# EAGLE design LCD_Shield_v1.0 (EAGLE 5.10)
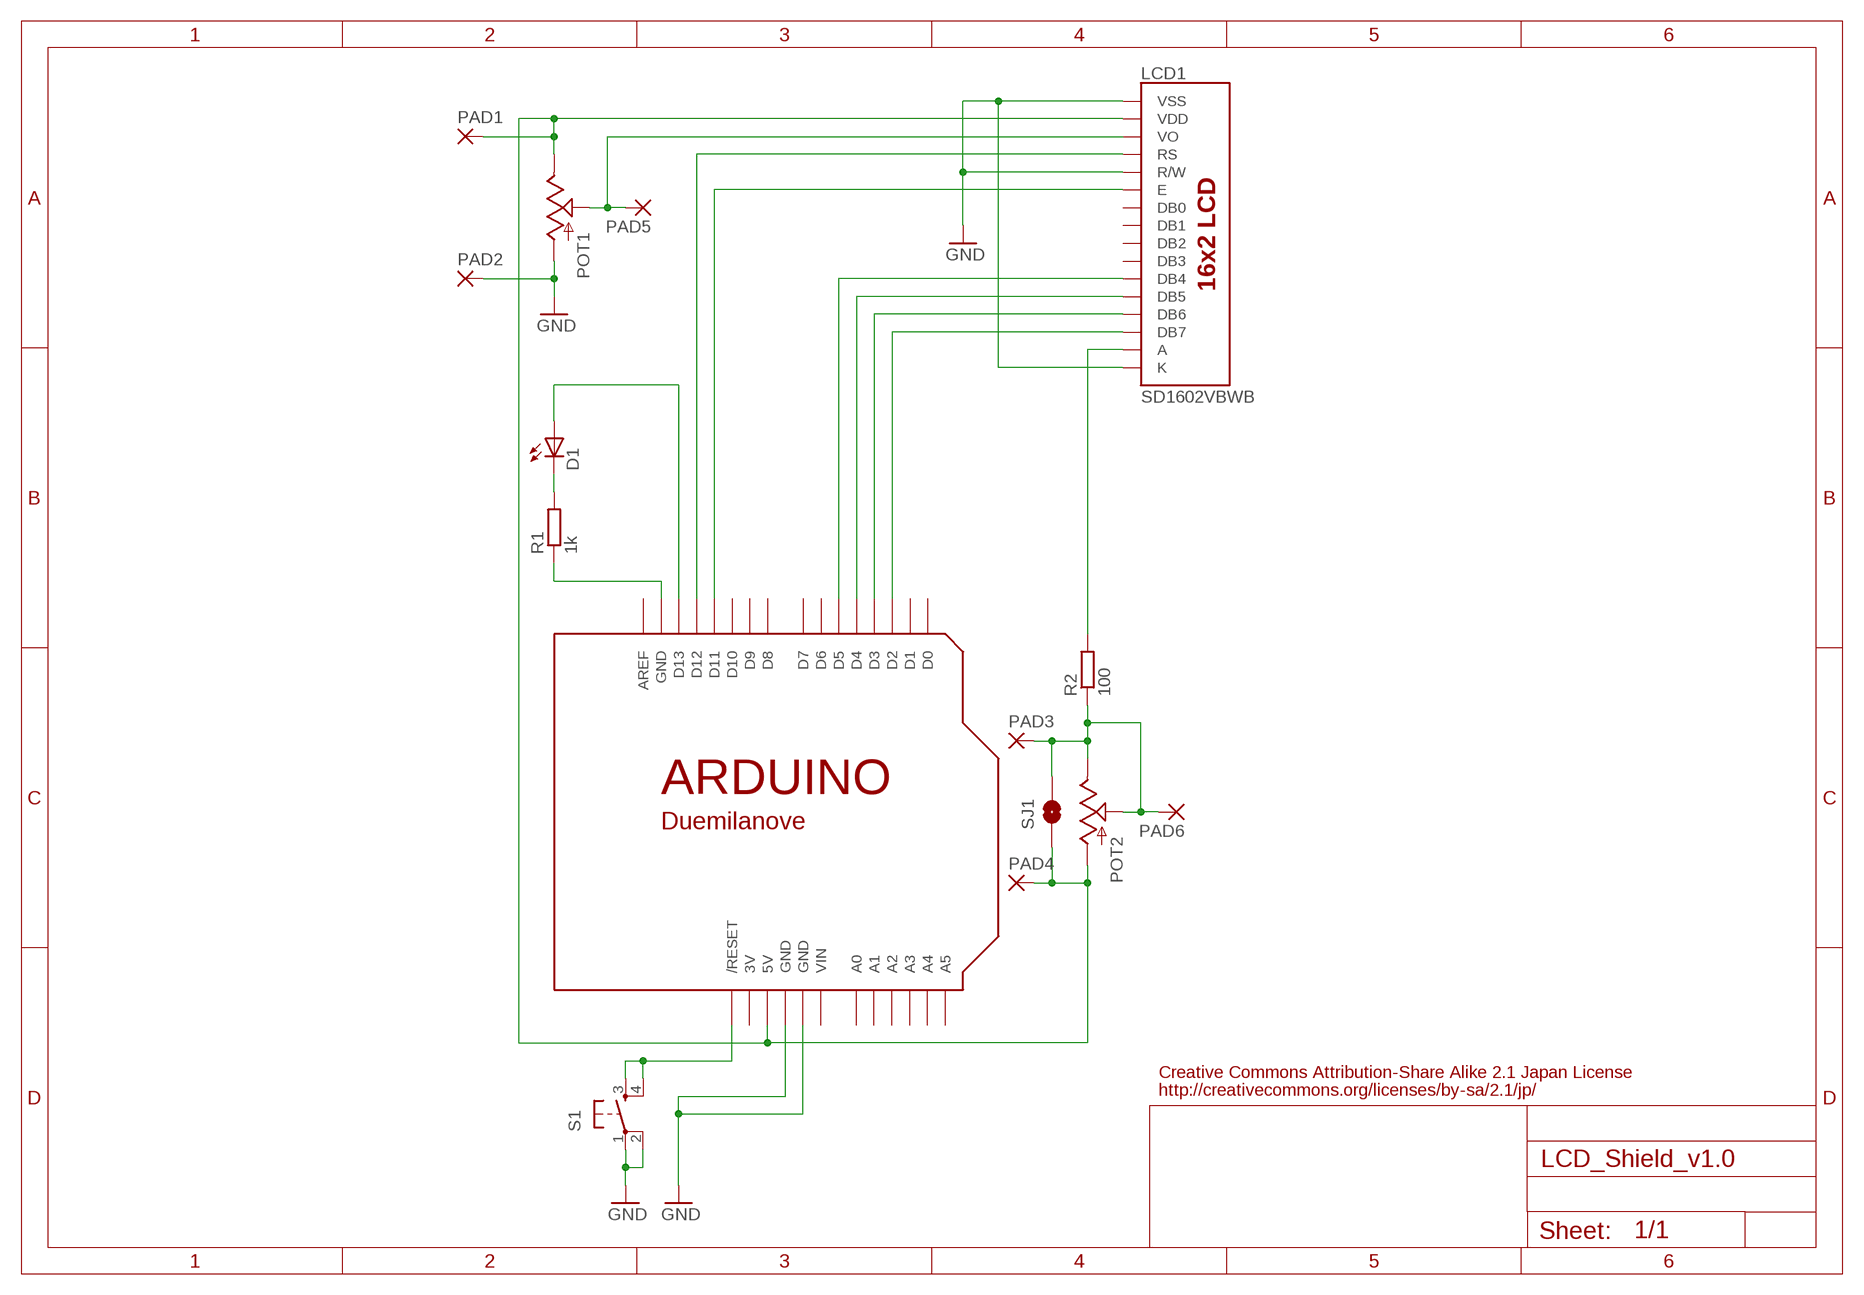
[diagram p0: schematic, sheet 1]

## Parts
D1  LED3MM  [LED3MM]
LCD1  SD1602VBWB  [SD1602VBWB]
PAD1  1,6/0,8  [1,6/0,8]
PAD2  1,6/0,8  [1,6/0,8]
PAD3  1,6/0,8  [1,6/0,8]
PAD4  1,6/0,8  [1,6/0,8]
PAD5  1,6/0,8  [1,6/0,8]
PAD6  1,6/0,8  [1,6/0,8]
POT1  POTTRIM  [TRIM_POT]
POT2  POTTRIM  [TRIM_POT]
R1  1k  R-EU_0207/10  [0207/10]
R2  100  R-EU_0207/10  [0207/10]
S1  TAC_SWITCHPTH  [TACTILE-PTH]
SJ1  SOLDERJUMPERNO  [SJ_2S-NO]
U$1  ARDUINODUEMILANOVE-NOHOLES  [ARDUINO-NOHOLE]

## Nets
GND: LCD1.P$01(VSS) LCD1.P$05(R/W) LCD1.P$16(K) PAD2.1(P) POT1.3(A) S1.1 S1.2 U$1.GND1(GND) U$1.GND2(GND)
N$1: D1.K(C) R1.2
N$2: R1.1 U$1.GND
N$3: LCD1.P$14(DB7) U$1.D2
N$4: LCD1.P$13(DB6) U$1.D3
N$6: LCD1.P$11(DB4) U$1.D5
N$12: LCD1.P$06(E) U$1.D11
N$13: LCD1.P$04(RS) U$1.D12
N$14: D1.A U$1.D13
N$15: PAD3.1(P) PAD6.1(P) POT2.1(S) POT2.2(E) R2.1 SJ1.2
N$26: LCD1.P$02(VDD) PAD1.1(P) PAD4.1(P) POT1.2(E) POT2.3(A) SJ1.1 U$1.5V
N$30: LCD1.P$15(A) R2.2
N$31: S1.3 S1.4 U$1.RESET(/RESET)
N$34: LCD1.P$03(VO) PAD5.1(P) POT1.1(S)
N$35: LCD1.P$12(DB5) U$1.D4
Unconnected: LCD1.P$07(DB0) LCD1.P$08(DB1) LCD1.P$09(DB2) LCD1.P$10(DB3) U$1.A0 U$1.A1 U$1.A2 U$1.A3 U$1.A4 U$1.A5 U$1.AREF U$1.D0 U$1.D1 U$1.D6 U$1.D7 U$1.D8 U$1.D9 U$1.D10

## Notes on the sheet
- Creative Commons Attribution-Share Alike 2.1 Japan License
- http://creativecommons.org/licenses/by-sa/2.1/jp/

## Power pins joined to a net without a drawn wire
3V: U$1.3V
VIN: U$1.VIN

## Library data of the parts
D1 = SparkFun:LED: LEDs Standard schematic elements and footprints for 5mm, 3mm, 1206, and 0603 sized LEDs. 5mm - Spark Fun Electronics SKU : COM-00529 (and others)
LCD1 = SUNLIKE_LCD_SD1602:SD1602VBWB
PAD1-PAD6 = wirepad:1,6/0,8: THROUGH-HOLE PAD
POT1 POT2 = SparkFun:POT
R1 R2 = rcl:R-EU_: RESISTOR, European symbol
S1 = SparkFun:TAC_SWITCH: Momentary Switch Button commonly used for reset or general input. Spark Fun Electronics SKU : COM-00097
SJ1 = SparkFun:SOLDERJUMPER: Solder Jumper Standard SMD solder jumper. Used to automate production. Two varients : Normally Open and Normally Closed are the same, but have different paste layers. NC will have a large amount of paste and should jumper during reflow.
U$1 = kotobuki:ARDUINO: Arduino Diecimila/Duemilanove Make a shield with ease, this package has all the named pins as well as the two mounting drill holes and an outline of the USB and DC power connector. The outline is on the DIMENSION layer, so if your board house uses it they will cut the outline to match. http://www.ladyada.net/library/pcb/eaglelibrary.html

## Board
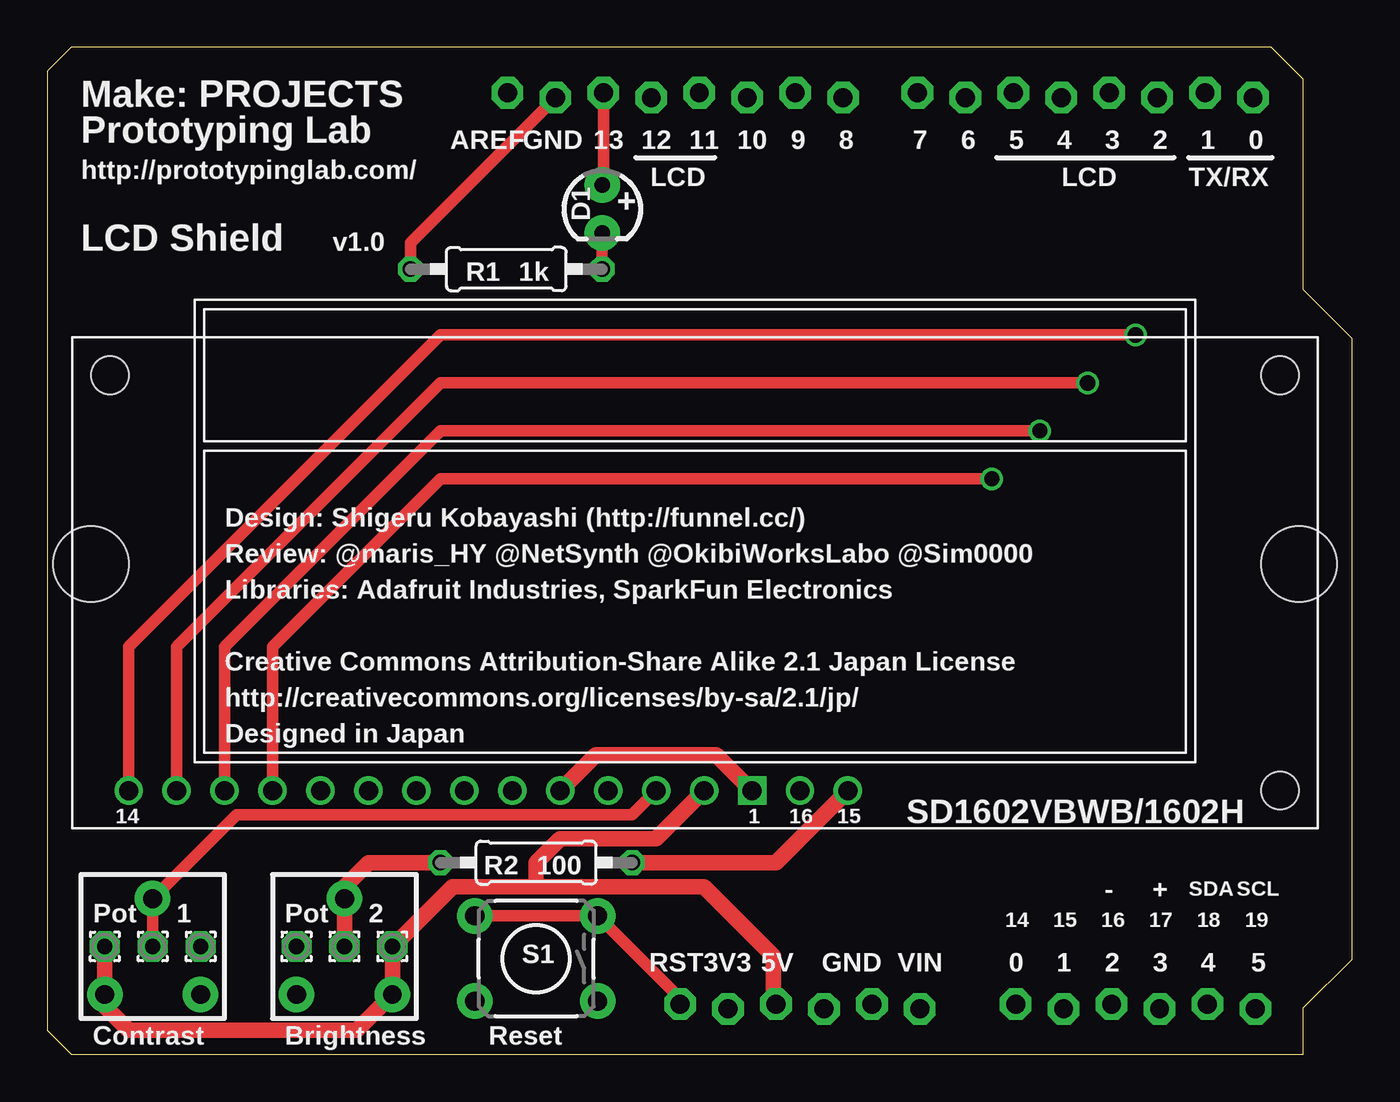
[diagram p1: board, top side]
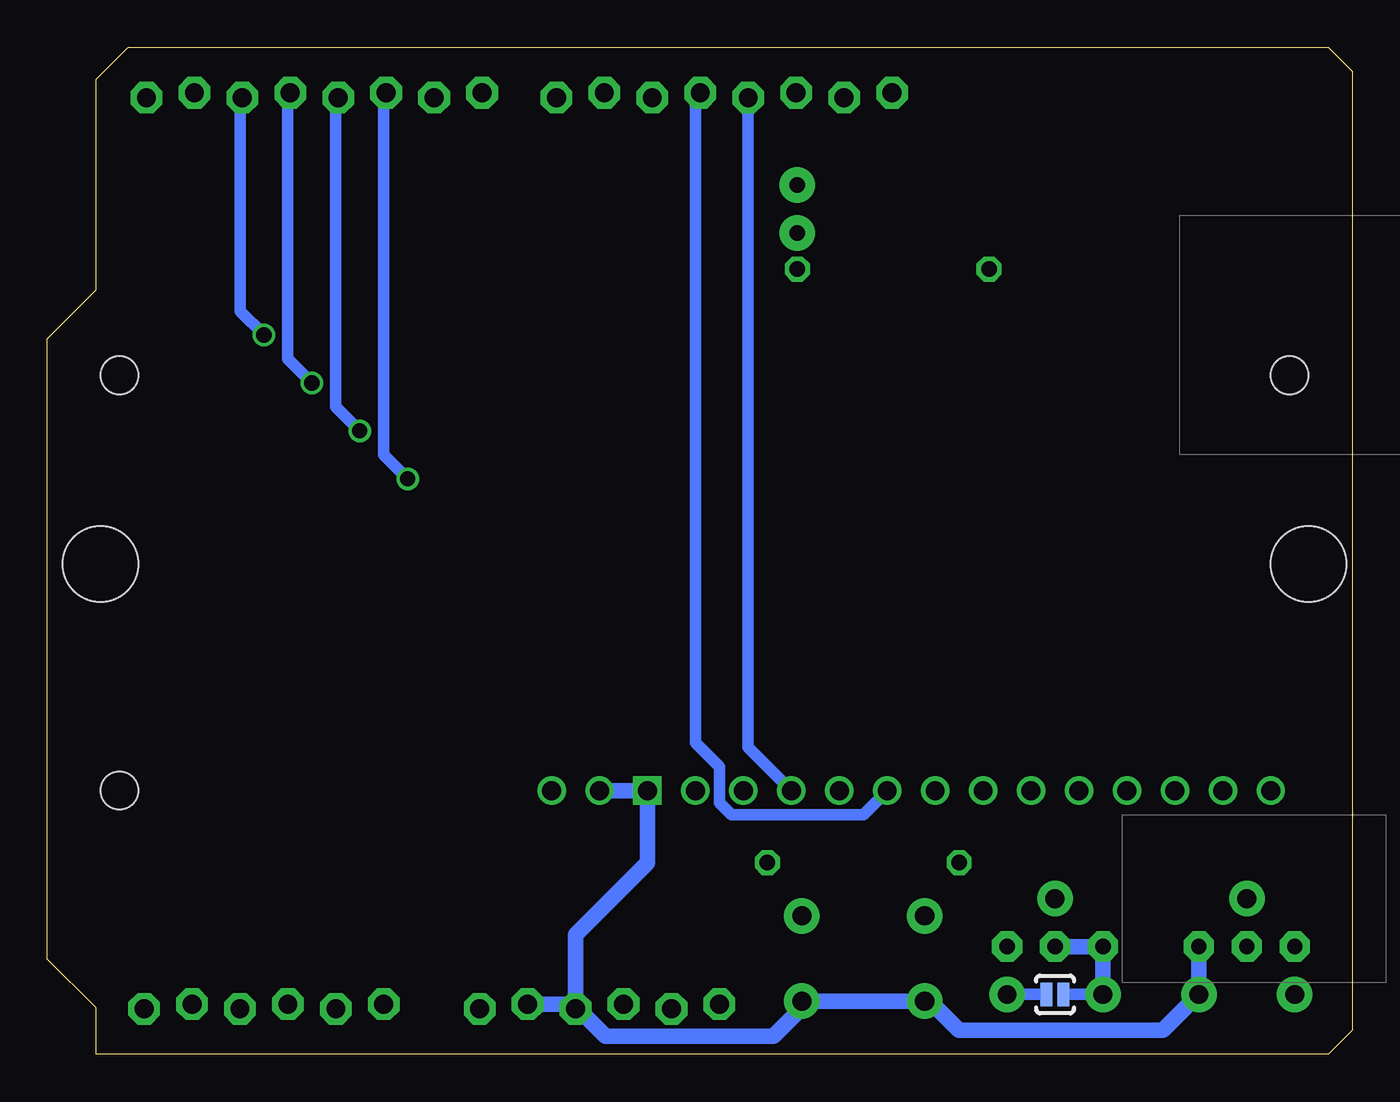
[diagram p2: board, bottom side, seen from below]

Size 69.14 x 53.34 mm. Coordinates in mm from the lower left corner, seen from the top.
Copper layers (1*16): Top 0.035mm / dielectric 1.5mm / Bottom 0.035mm
Design rules "Fusion_eagle_rule_v1.1 *": minimum track width 6mil, minimum drill 12mil, track to track 6mil, track to pad 6mil, pad to pad 6mil, via to via 6mil, smd to smd 0mil, copper to edge 10mil, drill to drill 10mil, minimum pad ring 10mil, minimum via ring 6mil, stop-mask expansion 2mil, vias tented up to drill 100mil, thermal gap 10mil

### Footprints (pad centres in the part's own frame; a part is rotated, then mirrored left to right if it is on the bottom)
LED3MM = drill 0.813 pad 1.88 round: A -1.27,0; K 1.27,0
SD1602VBWB = drill 1 square: P$01 33.02,0 | drill 1 round: P$02 30.48,0; P$03 27.94,0; P$04 25.4,0; P$05 22.86,0; P$06 20.32,0; P$07 17.78,0; P$08 15.24,0; P$09 12.7,0; P$10 10.16,0; P$11 7.62,0; P$12 5.08,0; P$13 2.54,0; P$14 0,0; P$15 38.1,0; P$16 35.56,0 | hole 4: -2,12; 62,12 | hole 2: -1,22; 61,22; 61,0
1,6/0,8 = drill 0.813 pad 1.6 octagon: 1 0,0
TRIM_POT = drill 1 pad 1.88 round: 1 5.08,0; 2 0,2.54; 3 0,-2.54
0207/10 = drill 0.813 octagon: 1 -5.08,0; 2 5.08,0
TACTILE-PTH = drill 1.016 pad 1.88 round: 1 -3.251,2.261; 2 3.251,2.261; 3 -3.251,-2.261; 4 3.251,-2.261
SJ_2S-NO = smd 0.635 x 1.27: 1 -0.45,0; 2 0.45,0
ARDUINO-NOHOLE = drill 1 pad 1.676 octagon: 3V 36.068,2.413; 5V 38.608,2.667; A0 51.308,2.667; A1 53.848,2.413; A2 56.388,2.667; A3 58.928,2.413; A4 61.468,2.667; A5 64.008,2.413; AREF 24.384,50.927; D0 63.881,50.673; D1 61.341,50.927; D2 58.801,50.673; D3 56.261,50.927; D4 53.721,50.673; D5 51.181,50.927; D6 48.641,50.673; D7 46.101,50.927; D8 42.164,50.673; D9 39.624,50.927; D10 37.084,50.673; D11 34.544,50.927; D12 32.004,50.673; D13 29.464,50.927; GND 26.924,50.673; GND1 43.688,2.667; GND2 41.148,2.413; RESET 33.528,2.667; VIN 46.228,2.413

### Placement (x,y rotation side)
D1  29.4,44.77 270 top
LCD1  4.32,13.97 0 top
PAD1  3.05,5.71 0 top
PAD2  8.13,5.71 0 top
PAD3  13.21,5.71 0 top
PAD4  18.29,5.71 0 top
PAD5  5.59,5.71 0 top
PAD6  15.75,5.71 0 top
POT1  5.59,3.18 90 top
POT2  15.75,3.18 90 top
R1  24.32,41.59 0 top
R2  25.91,10.16 0 top
S1  25.91,5.08 180 top
SJ1  15.75,3.18 0 bottom
U$1  0,0 0 top

### Tracks (layer width: path | path; a pad name or v marks a point on that pad's centre or on a via)
GND
  Top 0.813: LCD1.P$05 29.08,15.88 35.43,15.88 LCD1.P$01
  Bottom 0.61: 22.38,2.82 S1.2
  Bottom 0.813: LCD1.P$16 LCD1.P$01 37.34,10.16 41.15,6.35 U$1.GND2 | S1.2 S1.1 29.16,2.46 30.67,0.95 39.56,0.95 41.02,2.41 U$1.GND2 | PAD2.1 POT1.3 10.03,1.27 20.83,1.27 22.38,2.82 | U$1.GND1 41.4,2.67 U$1.GND2
N$1
  Top 0.61: R1.2 D1.K
N$2
  Top 0.61: R1.1 19.24,42.99 U$1.GND
N$3  (via drill 0.8)
  Top 0.61: LCD1.P$14 4.32,21.59 20.83,38.1 v57.66,38.1
  Bottom 0.61: v57.66,38.1 58.93,39.37 58.93,50.55 U$1.D2
N$4  (via drill 0.8)
  Top 0.61: LCD1.P$13 6.86,21.59 20.83,35.56 v55.12,35.56
  Bottom 0.61: v55.12,35.56 56.39,36.83 56.39,50.8 U$1.D3
N$6  (via drill 0.8)
  Top 0.61: LCD1.P$11 11.94,21.59 20.83,30.48 v50.04,30.48
  Bottom 0.61: v50.04,30.48 51.31,31.75 51.31,50.8 U$1.D5
N$12
  Bottom 0.61: LCD1.P$06 25.91,12.7 32.89,12.7 33.53,13.34 33.53,15.24 34.8,16.51 34.8,50.67 U$1.D11
N$13
  Bottom 0.61: U$1.D12 32,16.26 LCD1.P$04
N$14
  Top 0.61: D1.A 29.46,46.1 U$1.D13
N$15
  Top 0.813: R2.1 17.02,10.16 15.75,8.89 POT2.1 PAD6.1
  Bottom 0.61: POT2.2 SJ1.2
  Bottom 0.813: POT2.2 PAD3.1 PAD6.1
N$26
  Top 0.813: PAD1.1 POT1.2 3.05,2.54 4.32,1.27 16.38,1.27 POT2.3 PAD4.1 21.46,8.89 25.91,8.89 | 25.91,8.89 25.91,10.16 27.18,11.43 32.26,11.43 LCD1.P$02 | 25.91,8.89 34.8,8.89 38.48,5.21 38.48,2.67 U$1.5V
  Bottom 0.61: POT2.3 SJ1.1
N$30
  Top 0.813: LCD1.P$15 38.61,10.16 R2.2
N$31
  Top 0.61: S1.4 S1.3 33.53,2.97
  Top 0.813: 33.53,2.97 U$1.RESET
N$34
  Top 0.61: LCD1.P$03 30.99,12.7 10.03,12.7 POT1.1 PAD5.1
N$35  (via drill 0.8)
  Top 0.61: LCD1.P$12 9.4,21.59 20.83,33.02 v52.58,33.02
  Bottom 0.61: v52.58,33.02 53.85,34.29 53.85,50.55 U$1.D4

### Text on the board
tPlace: Contrast | Brightness
tNames: Make: PROJECTS | Prototyping Lab | http://prototypinglab.com/ | LCD | LCD | TX/RX | + | LCD Shield | v1.0 | Design: Shigeru Kobayashi (http://funnel.cc/) | Review: @maris_HY @NetSynth @OkibiWorksLabo @Sim0000 | Libraries: Adafruit Industries, SparkFun Electronics | Creative Commons Attribution-Share Alike 2.1 Japan License | http://creativecommons.org/licenses/by-sa/2.1/jp/ | Designed in Japan | - | + | SDA | SCL | Pot | 1 | Pot | 2 | 14 | 15 | 16 | 17 | 18 | 19 | Reset